# EasyEDA Pro project Summer Robot.eprj, schematic Motor Control Unit

## Sheets
1 Wrong Do Not Use!: Board Name: Motor Control Unit; Create Date: 2025-05-18; Page Name: P1; Project Name: Summer Robot; Schematic Name: Motor Control Unit; Update Date: 2025-12-27; Company: Ethan Reynolds; Drawn: 2025-05-17; Page Size: A4; Version: V1.0
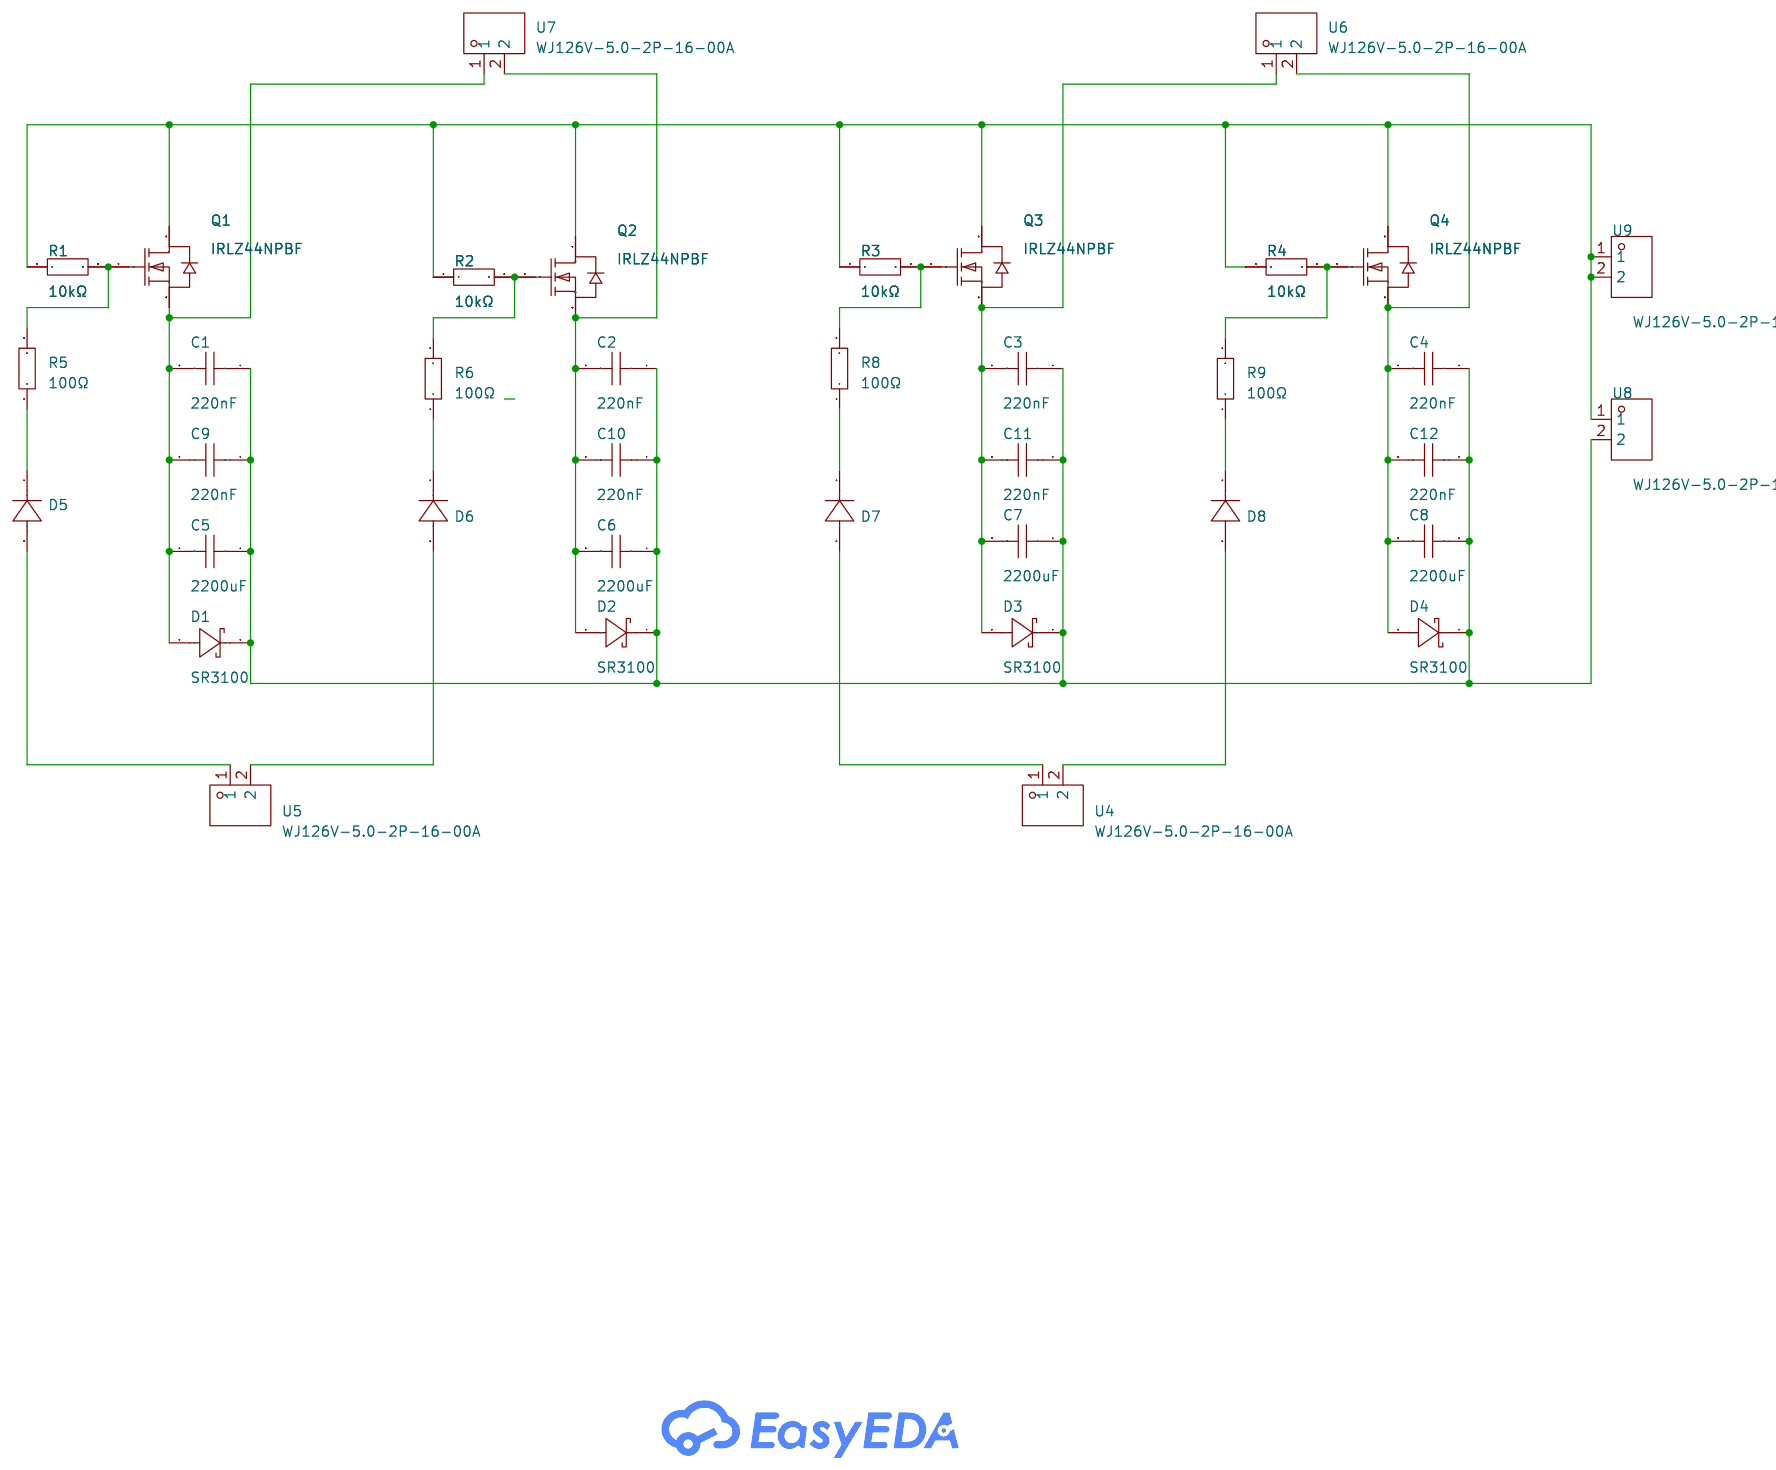
[diagram p0: Wrong Do Not Use!]
2 Revised: Create Date: 2026-01-07; Page Name: Revised; Update Date: 2026-01-06
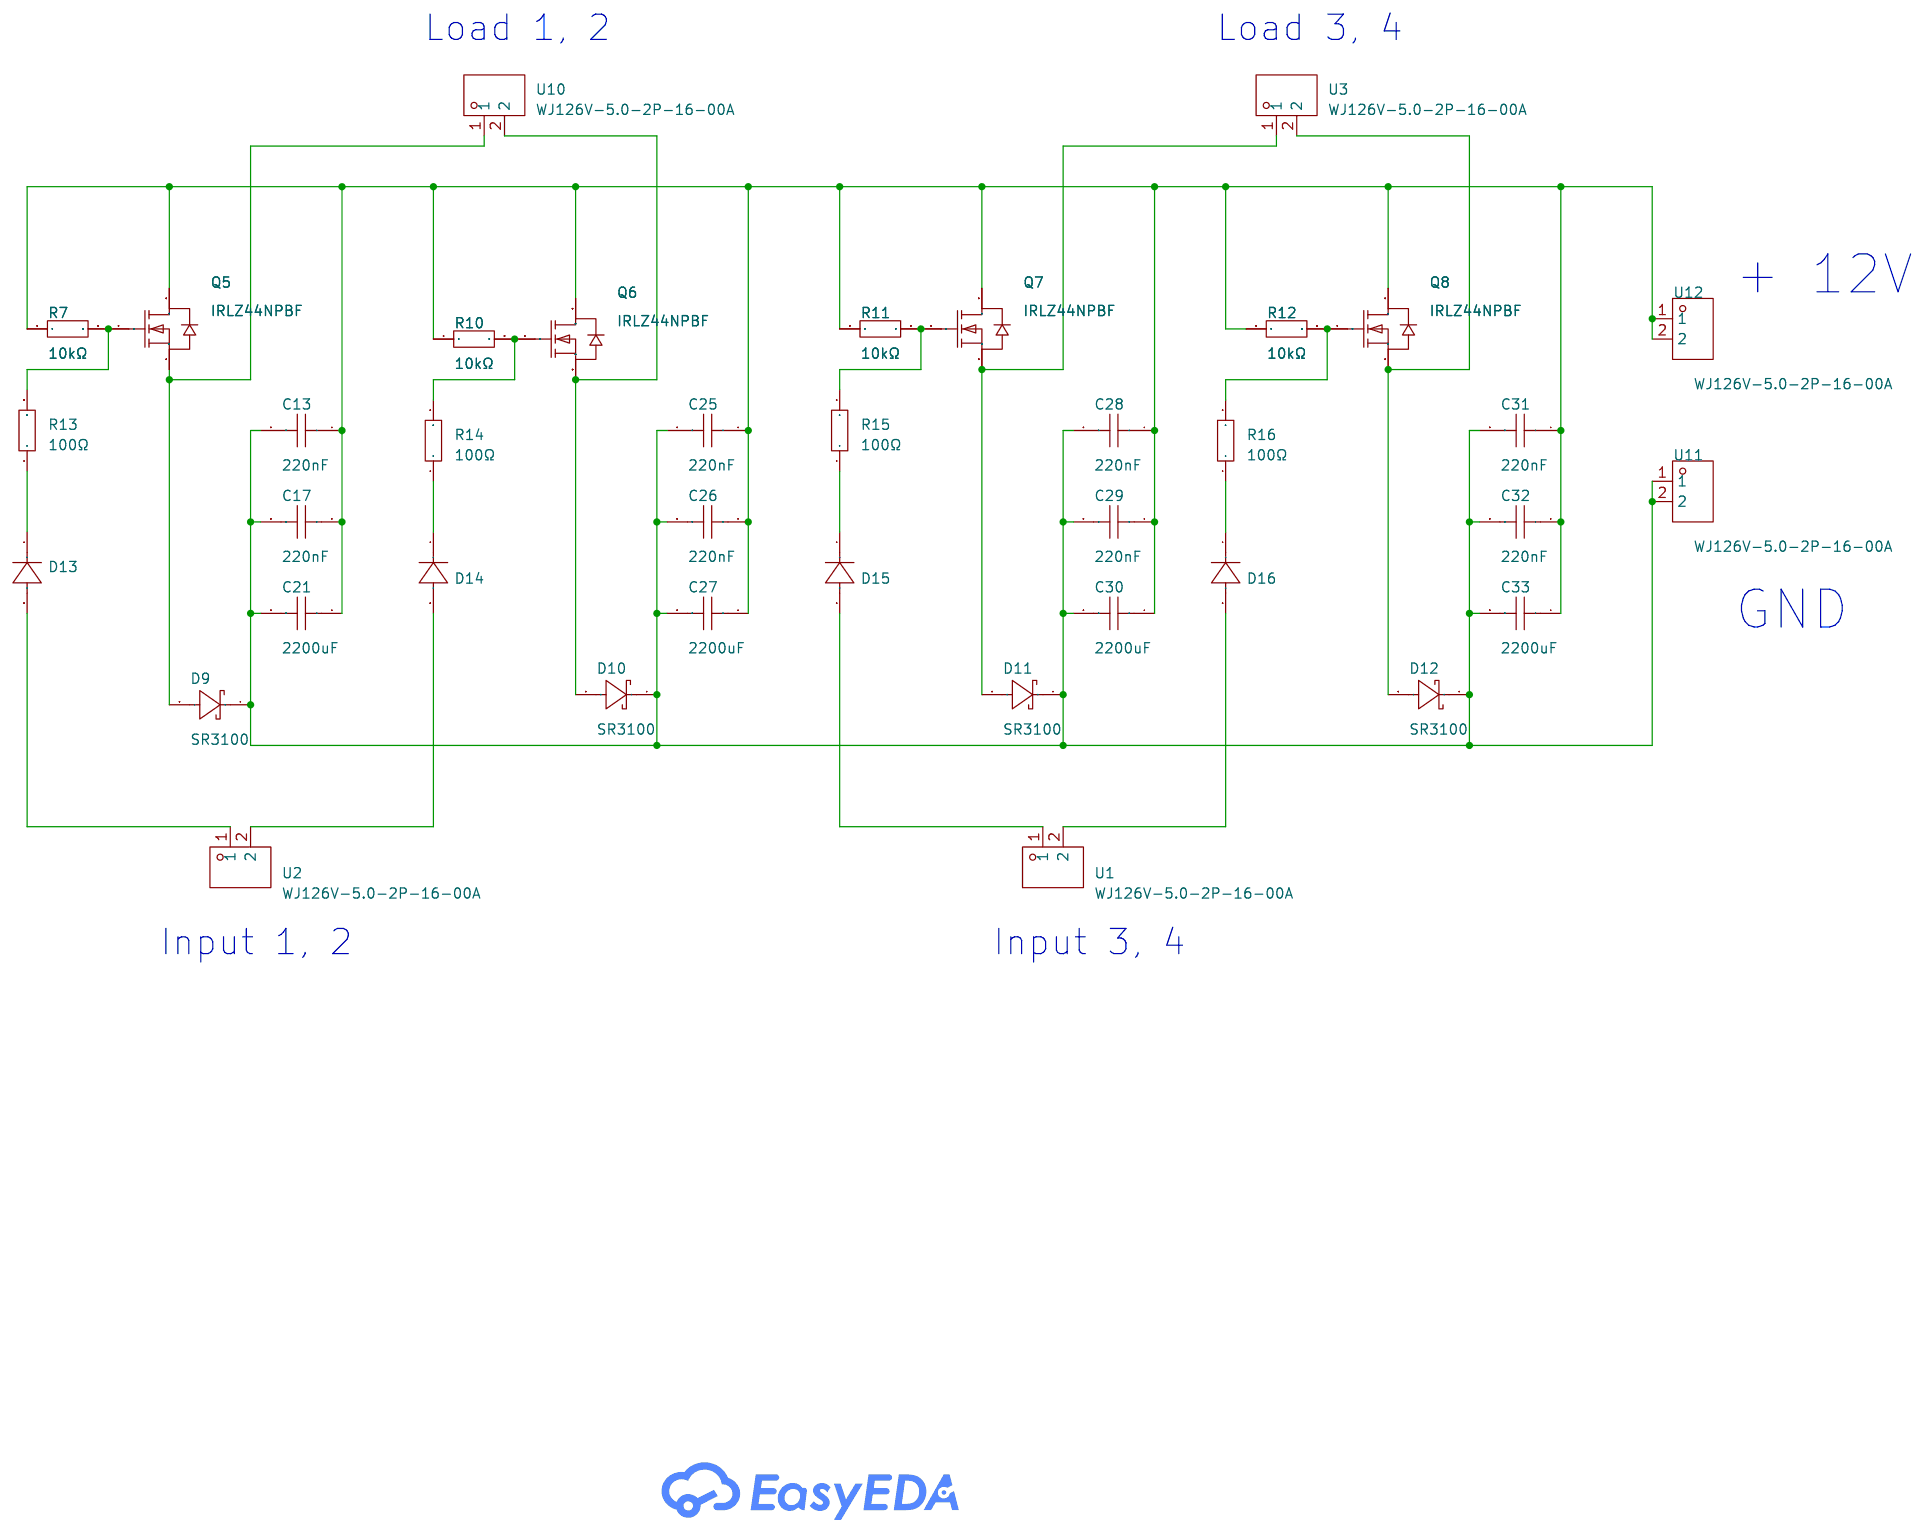
[diagram p1: Revised]
3 Final Version: Create Date: 2026-03-10; Page Name: Final Version; Update Date: 2026-03-09
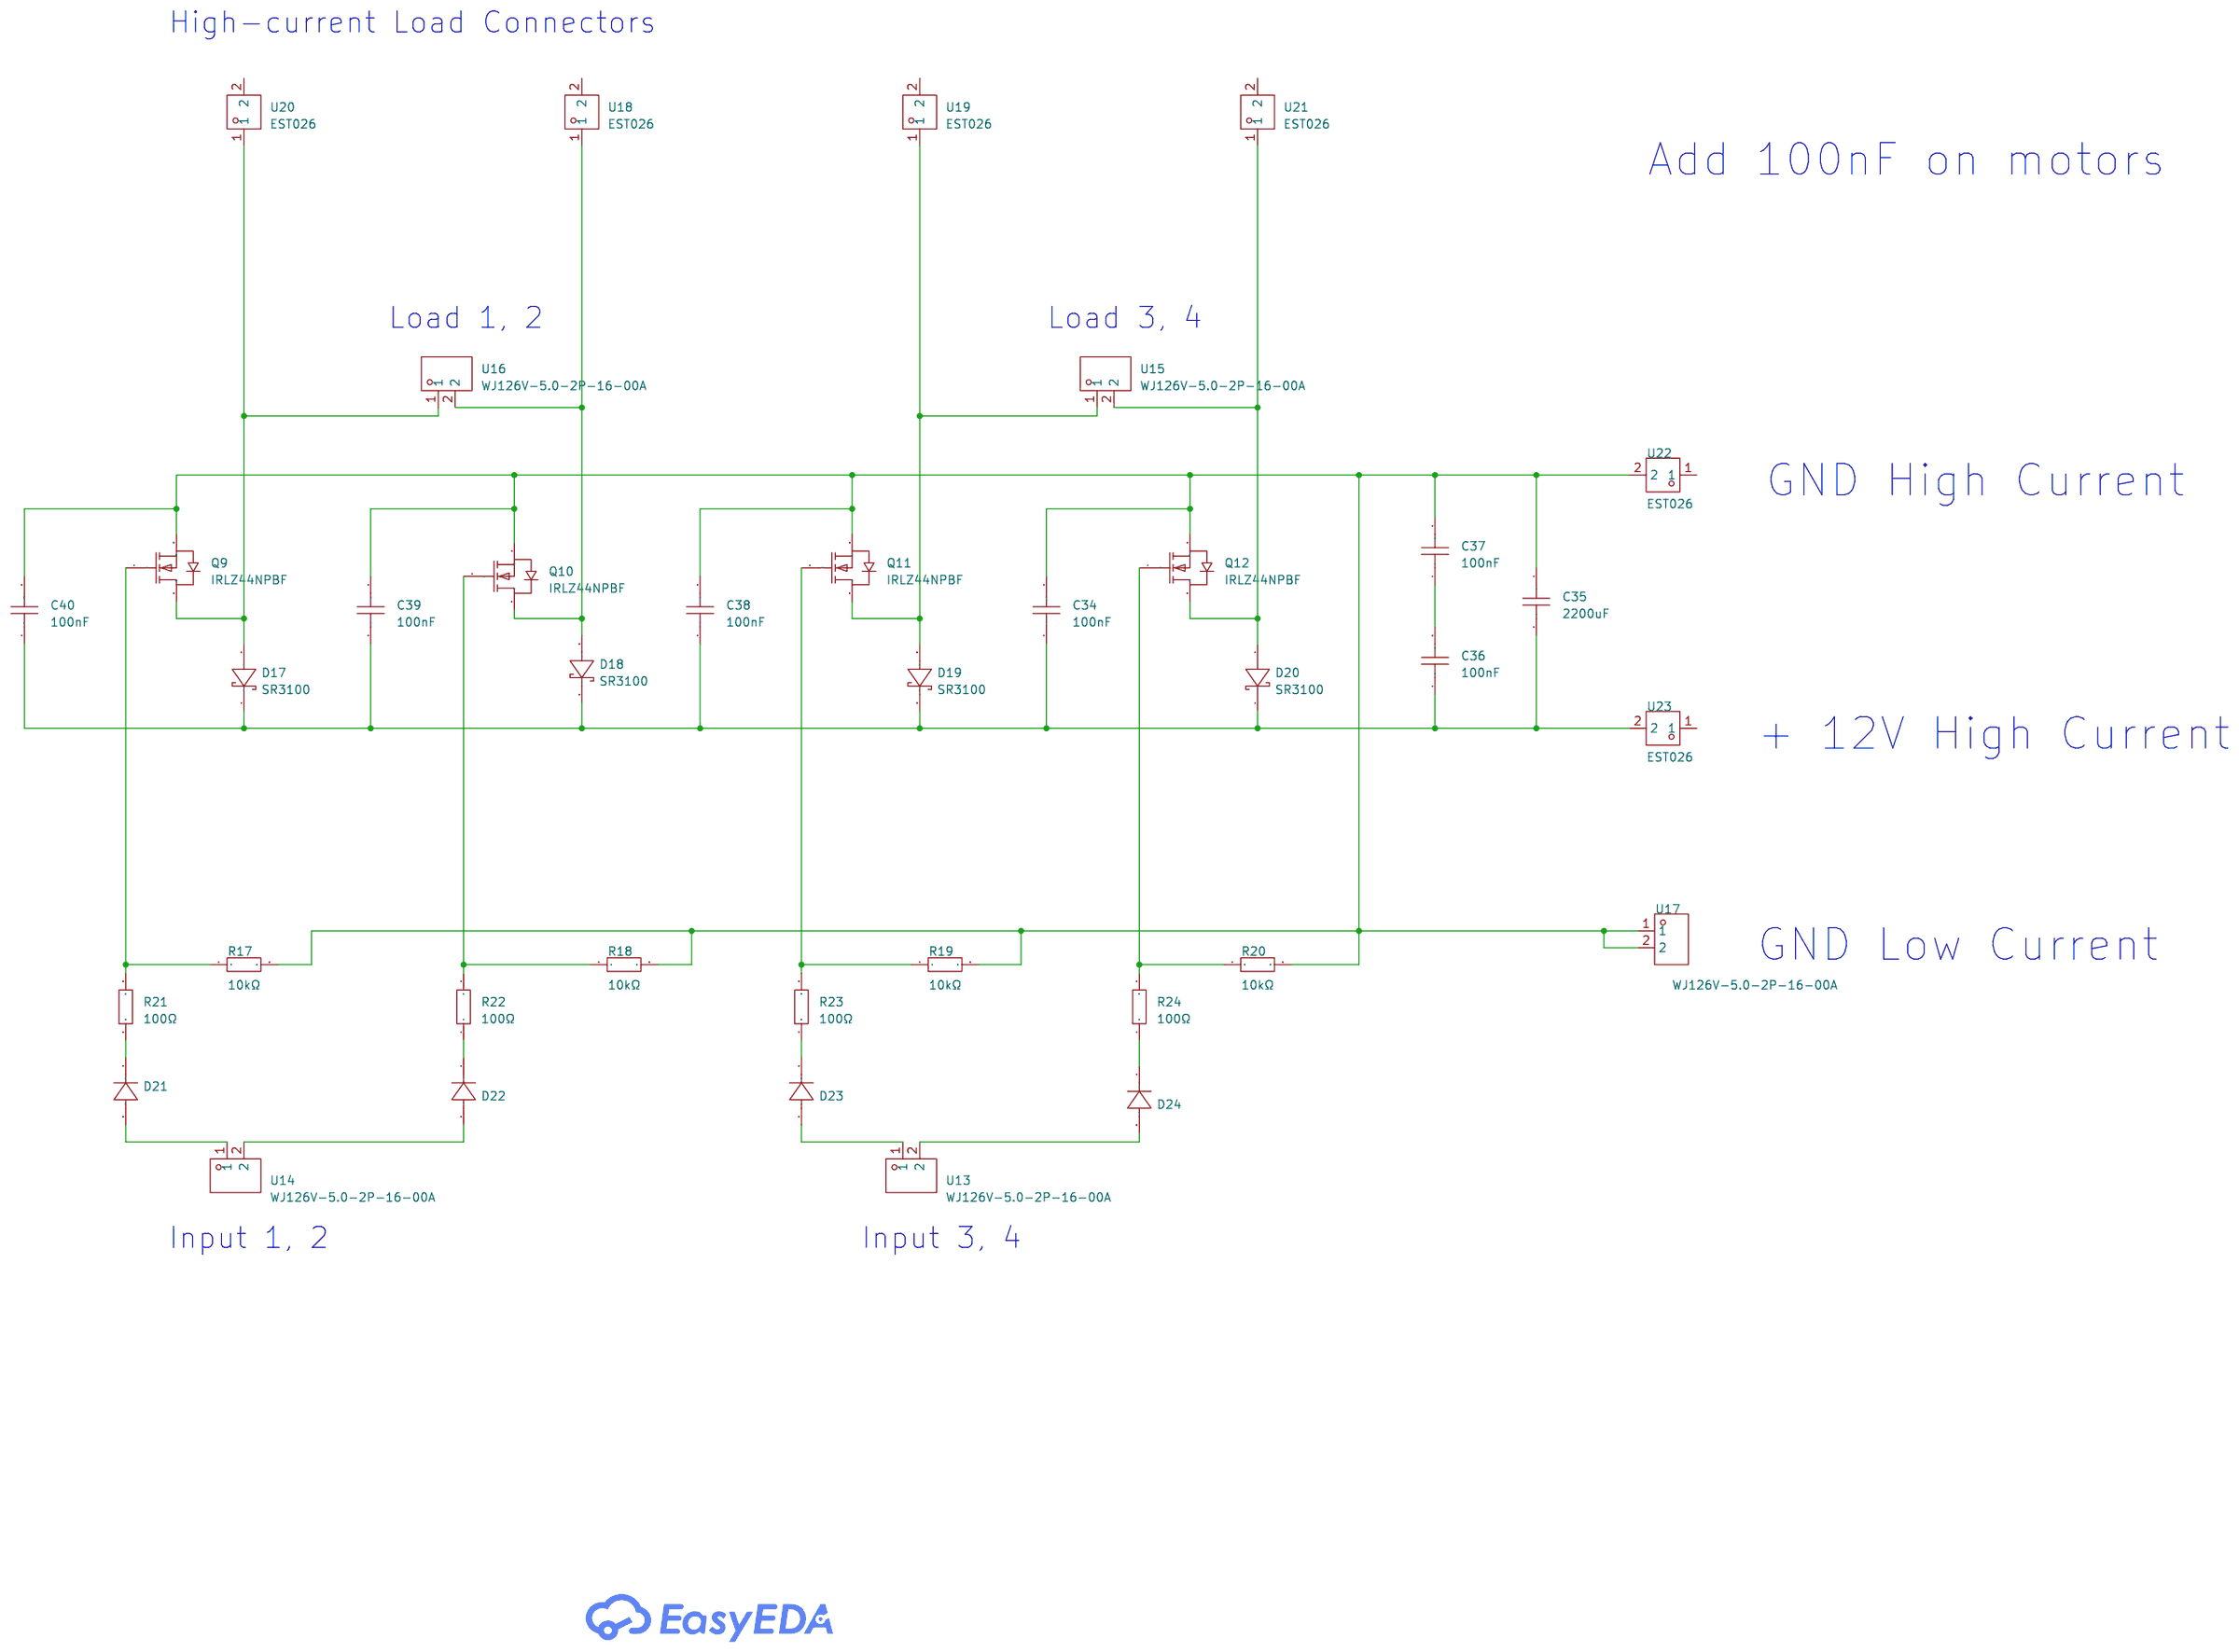
[diagram p2: Final Version]

## Parts
sheet Final Version
C34  100nF  [CAP-TH_L9.5-W4.5-P7.00-D0.5]
C35  2200uF  [CAP-TH_BD10.0-P5.00-D0.6-FD]
C36  100nF  [CAP-TH_L8.0-W4.5-P5.00-D0.5]
C37  100nF  [CAP-TH_L8.0-W4.5-P5.00-D0.5]
C38  100nF  [CAP-TH_L9.5-W4.5-P7.00-D0.5]
C39  100nF  [CAP-TH_L9.5-W4.5-P7.00-D0.5]
C40  100nF  [CAP-TH_L9.5-W4.5-P7.00-D0.5]
D17  SR3100  [DO-201AD_BD5.3-L8.4-P12.50-D1.4-RD]
D18  SR3100  [DO-201AD_BD5.3-L8.4-P12.50-D1.4-RD]
D19  SR3100  [DO-201AD_BD5.3-L8.4-P12.50-D1.4-RD]
D20  SR3100  [DO-201AD_BD5.3-L8.4-P12.50-D1.4-RD]
D21  -  [DO-41_BD2.4-L4.7-P8.70-D0.9-RD]
D22  -  [DO-41_BD2.4-L4.7-P8.70-D0.9-RD]
D23  -  [DO-41_BD2.4-L4.7-P8.70-D0.9-RD]
D24  -  [DO-41_BD2.4-L4.7-P8.70-D0.9-RD]
Q9  IRLZ44NPBF  [TO-220-3_L10.0-W4.5-P2.54-T]
Q10  IRLZ44NPBF  [TO-220-3_L10.0-W4.5-P2.54-T]
Q11  IRLZ44NPBF  [TO-220-3_L10.0-W4.5-P2.54-T]
Q12  IRLZ44NPBF  [TO-220-3_L10.0-W4.5-P2.54-T]
R17  10kΩ  [RES-TH_BD2.4-L6.3-P10.30-D0.6]
R18  10kΩ  [RES-TH_BD2.4-L6.3-P10.30-D0.6]
R19  10kΩ  [RES-TH_BD2.4-L6.3-P10.30-D0.6]
R20  10kΩ  [RES-TH_BD2.4-L6.3-P10.30-D0.6]
R21  100Ω  [RES-TH_BD4.0-L11.5-P15.50-D0.7]
R22  100Ω  [RES-TH_BD4.0-L11.5-P15.50-D0.7]
R23  100Ω  [RES-TH_BD4.0-L11.5-P15.50-D0.7]
R24  100Ω  [RES-TH_BD4.0-L11.5-P15.50-D0.7]
U13  WJ126V-5.0-2P-16-00A  [CONN-TH_WJ126V-5.0-2P]
U14  WJ126V-5.0-2P-16-00A  [CONN-TH_WJ126V-5.0-2P]
U15  WJ126V-5.0-2P-16-00A  [CONN-TH_WJ126V-5.0-2P]
U16  WJ126V-5.0-2P-16-00A  [CONN-TH_WJ126V-5.0-2P]
U17  WJ126V-5.0-2P-16-00A  [CONN-TH_WJ126V-5.0-2P]
U18  EST026  [CONN-TH_L6.3-W0.8-EST026]
U19  EST026  [CONN-TH_L6.3-W0.8-EST026]
U20  EST026  [CONN-TH_L6.3-W0.8-EST026]
U21  EST026  [CONN-TH_L6.3-W0.8-EST026]
U22  EST026  [CONN-TH_L6.3-W0.8-EST026]
U23  EST026  [CONN-TH_L6.3-W0.8-EST026]
sheet Revised
C13  220nF  [CAP-TH_L10.0-W2.7-P7.80-D0.4]
C17  220nF  [CAP-TH_L10.0-W2.7-P7.80-D0.4]
C21  2200uF  [CAP-TH_BD10.0-P5.00-D0.6-FD]
C25  220nF  [CAP-TH_L10.0-W2.7-P7.80-D0.4]
C26  220nF  [CAP-TH_L10.0-W2.7-P7.80-D0.4]
C27  2200uF  [CAP-TH_BD10.0-P5.00-D0.6-FD]
C28  220nF  [CAP-TH_L10.0-W2.7-P7.80-D0.4]
C29  220nF  [CAP-TH_L10.0-W2.7-P7.80-D0.4]
C30  2200uF  [CAP-TH_BD10.0-P5.00-D0.6-FD]
C31  220nF  [CAP-TH_L10.0-W2.7-P7.80-D0.4]
C32  220nF  [CAP-TH_L10.0-W2.7-P7.80-D0.4]
C33  2200uF  [CAP-TH_BD10.0-P5.00-D0.6-FD]
D9  SR3100  [DO-201AD_BD5.3-L8.4-P12.50-D1.4-RD]
D10  SR3100  [DO-201AD_BD5.3-L8.4-P12.50-D1.4-RD]
D11  SR3100  [DO-201AD_BD5.3-L8.4-P12.50-D1.4-RD]
D12  SR3100  [DO-201AD_BD5.3-L8.4-P12.50-D1.4-RD]
D13  -  [DO-41_BD2.4-L4.7-P8.70-D0.9-RD]
D14  -  [DO-41_BD2.4-L4.7-P8.70-D0.9-RD]
D15  -  [DO-41_BD2.4-L4.7-P8.70-D0.9-RD]
D16  -  [DO-41_BD2.4-L4.7-P8.70-D0.9-RD]
Q5  IRLZ44NPBF  [TO-220-3_L10.0-W4.5-P2.54-T]
Q6  IRLZ44NPBF  [TO-220-3_L10.0-W4.5-P2.54-T]
Q7  IRLZ44NPBF  [TO-220-3_L10.0-W4.5-P2.54-T]
Q8  IRLZ44NPBF  [TO-220-3_L10.0-W4.5-P2.54-T]
R7  10kΩ  [RES-TH_BD2.4-L6.3-P10.30-D0.6]
R10  10kΩ  [RES-TH_BD2.4-L6.3-P10.30-D0.6]
R11  10kΩ  [RES-TH_BD2.4-L6.3-P10.30-D0.6]
R12  10kΩ  [RES-TH_BD2.4-L6.3-P10.30-D0.6]
R13  100Ω  [RES-TH_BD4.0-L11.5-P15.50-D0.7]
R14  100Ω  [RES-TH_BD4.0-L11.5-P15.50-D0.7]
R15  100Ω  [RES-TH_BD4.0-L11.5-P15.50-D0.7]
R16  100Ω  [RES-TH_BD4.0-L11.5-P15.50-D0.7]
U1  WJ126V-5.0-2P-16-00A  [CONN-TH_WJ126V-5.0-2P]
U2  WJ126V-5.0-2P-16-00A  [CONN-TH_WJ126V-5.0-2P]
U3  WJ126V-5.0-2P-16-00A  [CONN-TH_WJ126V-5.0-2P]
U10  WJ126V-5.0-2P-16-00A  [CONN-TH_WJ126V-5.0-2P]
U11  WJ126V-5.0-2P-16-00A  [CONN-TH_WJ126V-5.0-2P]
U12  WJ126V-5.0-2P-16-00A  [CONN-TH_WJ126V-5.0-2P]
sheet Wrong Do Not Use!
C1  220nF  [CAP-TH_L10.0-W2.7-P7.80-D0.4]
C2  220nF  [CAP-TH_L10.0-W2.7-P7.80-D0.4]
C3  220nF  [CAP-TH_L10.0-W2.7-P7.80-D0.4]
C4  220nF  [CAP-TH_L10.0-W2.7-P7.80-D0.4]
C5  2200uF  [CAP-TH_BD10.0-P5.00-D0.6-FD]
C6  2200uF  [CAP-TH_BD10.0-P5.00-D0.6-FD]
C7  2200uF  [CAP-TH_BD10.0-P5.00-D0.6-FD]
C8  2200uF  [CAP-TH_BD10.0-P5.00-D0.6-FD]
C9  220nF  [CAP-TH_L10.0-W2.7-P7.80-D0.4]
C10  220nF  [CAP-TH_L10.0-W2.7-P7.80-D0.4]
C11  220nF  [CAP-TH_L10.0-W2.7-P7.80-D0.4]
C12  220nF  [CAP-TH_L10.0-W2.7-P7.80-D0.4]
D1  SR3100  [DO-201AD_BD5.3-L8.4-P12.50-D1.4-RD]
D2  SR3100  [DO-201AD_BD5.3-L8.4-P12.50-D1.4-RD]
D3  SR3100  [DO-201AD_BD5.3-L8.4-P12.50-D1.4-RD]
D4  SR3100  [DO-201AD_BD5.3-L8.4-P12.50-D1.4-RD]
D5  -  [DO-41_BD2.4-L4.7-P8.70-D0.9-RD]
D6  -  [DO-41_BD2.4-L4.7-P8.70-D0.9-RD]
D7  -  [DO-41_BD2.4-L4.7-P8.70-D0.9-RD]
D8  -  [DO-41_BD2.4-L4.7-P8.70-D0.9-RD]
Q1  IRLZ44NPBF  [TO-220-3_L10.0-W4.5-P2.54-T]
Q2  IRLZ44NPBF  [TO-220-3_L10.0-W4.5-P2.54-T]
Q3  IRLZ44NPBF  [TO-220-3_L10.0-W4.5-P2.54-T]
Q4  IRLZ44NPBF  [TO-220-3_L10.0-W4.5-P2.54-T]
R1  10kΩ  [RES-TH_BD2.4-L6.3-P10.30-D0.6]
R2  10kΩ  [RES-TH_BD2.4-L6.3-P10.30-D0.6]
R3  10kΩ  [RES-TH_BD2.4-L6.3-P10.30-D0.6]
R4  10kΩ  [RES-TH_BD2.4-L6.3-P10.30-D0.6]
R5  100Ω  [RES-TH_BD4.0-L11.5-P15.50-D0.7]
R6  100Ω  [RES-TH_BD4.0-L11.5-P15.50-D0.7]
R8  100Ω  [RES-TH_BD4.0-L11.5-P15.50-D0.7]
R9  100Ω  [RES-TH_BD4.0-L11.5-P15.50-D0.7]
U4  WJ126V-5.0-2P-16-00A  [CONN-TH_WJ126V-5.0-2P]
U5  WJ126V-5.0-2P-16-00A  [CONN-TH_WJ126V-5.0-2P]
U6  WJ126V-5.0-2P-16-00A  [CONN-TH_WJ126V-5.0-2P]
U7  WJ126V-5.0-2P-16-00A  [CONN-TH_WJ126V-5.0-2P]
U8  WJ126V-5.0-2P-16-00A  [CONN-TH_WJ126V-5.0-2P]
U9  WJ126V-5.0-2P-16-00A  [CONN-TH_WJ126V-5.0-2P]

## Library data of the parts
C34 C38-C40 = 2A104J114CL006: Capacitance:100nF Tolerance:±5% Tolerance:±5% Voltage Rating:100V Dielectric Material:Polyester Operating Temperature:-40℃~+85℃ Operating Temperature:-40℃~+85℃; LCSC Part Name: 100nF ±5% 100V; Supplier Part: C2764150; Manufacturer: KNSCHA(科尼盛); Supplier Footprint: 插件,P=7mm; JLCPCB Part Class: Extended Part; Datasheet: https://item.szlcsc.com/datasheet/2A104J114CL006/2895837.html; Supplier: LCSC; Tolerance: ±5%; Voltage Rating: 100V; Dielectric Material: Polyester; Operating Temperature: -40℃~+85℃
C5-C8 C21 C27 C30 C33 C35 = EKZE160ELL222MJ25S: Capacitance: Tolerance:±20% Tolerance:±20% Rated Voltage: Ripple Current:- Equivalent Series Resistance(ESR):- Lead Spacing: φD: L: Lifetime @ Temp:5000hrs@105℃; LCSC Part Name: 2200uF ±20% 16V; Supplier Part: C320010; Manufacturer: NCC(日本贵弥功); Supplier Footprint: 插件,D10xL25mm; JLCPCB Part Class: Extended Part; Datasheet: https://atta.szlcsc.com/upload/public/pdf/source/20190311/C320010_4ADC44D1D3213EF7D3C5B91987F675CC.pdf; Supplier: LCSC; Tolerance: ±20%; Lifetime @ Temp: 5000hrs@105℃
C36 C37 = CL11-2A104J-100V: Capacitance:100nF Tolerance:±5% Tolerance:±5% Voltage Rating:100V Dielectric Material:Polyester Operating Temperature:-40℃~+85℃ Operating Temperature:-40℃~+85℃; LCSC Part Name: 100nF ±5% 100V; Supplier Part: C914544; Manufacturer: NDF(达孚); Supplier Footprint: 插件,P=5mm; JLCPCB Part Class: Extended Part; Datasheet: https://item.szlcsc.com/datasheet/CL11-2A104J-100V/985442.html; Supplier: LCSC; Tolerance: ±5%; Voltage Rating: 100V; Dielectric Material: Polyester; Operating Temperature: -40℃~+85℃
D1-D4 D9-D12 D17-D20 = SR3100_C698900: LCSC Part Name: 电压:100V 电流:3A; Supplier Part: C698900; Manufacturer: YANGJIE(扬杰); Supplier Footprint: DO-27; JLCPCB Part Class: Extended Part; Datasheet: https://atta.szlcsc.com/upload/public/pdf/source/20200709/C698900_6D78AD0DF45561612416347AC03E8208.pdf; Supplier: LCSC; Diode Configuration: Independent Type; Voltage - Forward(Vf@If): 850mV@3A; Voltage - DC Reverse(Vr): 100V; Current - Rectified: 3A; Reverse Leakage Current (Ir): 100uA@100V
D5-D8 D13-D16 D21-D24 = 1N4007: Supplier Footprint: DO-41
Q1-Q12 = IRLZ44NPBF: LCSC Part Name: 1个N沟道 耐压:55V 电流:47A; Supplier Part: C38774; Manufacturer: Infineon(英飞凌); Supplier Footprint: TO-220AB; JLCPCB Part Class: Extended Part; Datasheet: https://atta.szlcsc.com/upload/public/pdf/source/20141125/1457707250505.pdf; Supplier: LCSC; Type: 1 N-Channel; Drain Source On Resistance (RDS(on)@Vgs,Id): 0.025Ω@5.0V,25A; Gate Threshold Voltage (Vgs(th)@Id): 1V@250uA; Total Gate Charge (Qg@Vgs): 48nC; Input Capacitance (Ciss@Vds): 1.7nF; Reverse Transfer Capacitance (Crss@Vds): 150pF; Operating Temperature: -55℃~+175℃
R1-R4 R7 R10-R12 R17-R20 = RN1/4W10KFT/BA1: Type:Metal Film Resistors Resistance:10kΩ Tolerance:±1% Tolerance:±1% Voltage-Supply(Max):250V Power(Watts):1/4W Temperature Coefficient:±50ppm/℃ Temperature Coefficient:±50ppm/℃ Operating Temperature:-55℃~+125℃ Operating Temperature:-55℃~+125℃; LCSC Part Name: 10kΩ ±1% 250mW 金属膜电阻; Supplier Part: C410695; Manufacturer: Tyohm(幸亚电阻); Supplier Footprint: 插件,D2.4xL6.5mm; JLCPCB Part Class: Extended Part; Datasheet: https://atta.szlcsc.com/upload/public/pdf/source/20250211/2C0505E212032D72CE625B2E6B5197BA.pdf; Supplier: LCSC; Type: Metal Film Resistors; Tolerance: ±1%; Voltage-Supply(Max): 250V; Power(Watts): 1/4W; Temperature Coefficient: ±50ppm/℃; Operating Temperature: -55℃~+125℃
R5 R6 R8 R9 R13-R16 R21-R24 = MF1W-100Ω±1% T: Type:Metal Film Resistors Resistance: Tolerance:±1% Tolerance:±1% Voltage-Supply(Max):350V Power(Watts):1W Temperature Coefficient:±100ppm/℃ Temperature Coefficient:±100ppm/℃ Operating Temperature:-55℃~+155℃ Operating Temperature:-55℃~+155℃; LCSC Part Name: 100Ω ±1% 1W 金属膜电阻; Supplier Part: C119469; Manufacturer: CCO(千志电子); Supplier Footprint: 插件,D4.5xL11.5mm; JLCPCB Part Class: Extended Part; Datasheet: https://atta.szlcsc.com/upload/public/pdf/source/20190910/C427326_62A6D058BC0FF74963A2F22379CA06CE.pdf; Supplier: LCSC; Type: Metal Film Resistors; Tolerance: ±1%; Voltage-Supply(Max): 350V; Power(Watts): 1W; Temperature Coefficient: ±100ppm/℃; Operating Temperature: -55℃~+155℃
U1-U17 = WJ126V-5.0-2P-16-00A: LCSC Part Name: 直插式/5.0mm 2P 红色; Supplier Part: C3031437; Manufacturer: KANGNEX(康奈克斯电气); Supplier Footprint: P=5mm; JLCPCB Part Class: Extended Part; Datasheet: https://atta.szlcsc.com/upload/public/pdf/source/20191225/C8379_3D37D98EF6F0ECCD8D2EB72C93E46299.pdf; Supplier: LCSC
U18-U23 = EST026: LCSC Part Name: 插片端子-6.3mm; Supplier Part: C52878; Manufacturer: xcfuse(旭程); Supplier Footprint: 插件; JLCPCB Part Class: Extended Part; Datasheet: https://item.szlcsc.com/datasheet/EST026/53893.html; Supplier: LCSC
C1-C4 C9-C13 C17 C25 C26 C28 C29 C31 C32 = MPE224J100V82CL0045: Capacitance:220nF Tolerance:±5% Tolerance:±5% Voltage Rated: Dielectric Material:Metallized Polyester Operating Temperature:-55℃~+85℃ Operating Temperature:-55℃~+85℃; LCSC Part Name: 220nF ±5% 100V; Supplier Part: C2803185; Manufacturer: KNSCHA(科尼盛); Supplier Footprint: 插件,P=5mm; JLCPCB Part Class: Extended Part; Datasheet: https://atta.szlcsc.com/upload/public/pdf/source/20210420/C2803185_E3321C8762E86646BB5DB6CDE5AB9948.pdf; Supplier: LCSC; Tolerance: ±5%; Dielectric Material: Metallized Polyester; Operating Temperature: -55℃~+85℃

## Nets
$5N1382: Q11.1(G) R19.1 R23.2
$5N1386: Q9.1(G) R17.1 R21.2
$5N1571: D22.1(K) R22.1
$5N1611: D21.1(K) R21.1
$5N2155: D21.2(A) U14.1
$5N2160: D22.2(A) U14.2
$5N19714: Q12.1(G) R20.1 R24.2
$5N20412: Q10.1(G) R18.1 R22.2
$5N20429: D23.2(A) U13.1
$5N20459: D23.1(K) R23.1
$5N20478: D24.2(A) U13.2
$5N20531: D24.1(K) R24.1
$5N21225: D20.2(A) Q12.2(D) U15.2 U21.1
$5N21289: D17.2(A) Q9.2(D) U16.1 U20.1
$5N21351: D18.2(A) Q10.2(D) U16.2 U18.1
$5N21413: D19.2(A) Q11.2(D) U15.1 U19.1
$5N21508: C36.2 C37.1
Net-(C1-1): C1.1 C2.1 C3.1 C4.1 C5.1 C6.1 C7.1 C8.1 C9.1 C10.1 C11.1 C12.1 D1.1(K) D2.1(K) D3.1(K) D4.1(K) U8.2
Net-(C1-2): C1.2 C5.2 C9.2 D1.2(A) Q1.3(S) U7.1
Net-(C2-2): C2.2 C6.2 C10.2 D2.2(A) Q2.3(S) U7.2
Net-(C3-2): C3.2 C7.2 C11.2 D3.2(A) Q3.3(S) U6.1
Net-(C4-2): C4.2 C8.2 C12.2 D4.2(A) Q4.3(S) U6.2
Net-(C13-1): C13.1 C17.1 C21.1 C25.1 C26.1 C27.1 C28.1 C29.1 C30.1 C31.1 C32.1 C33.1 Q5.2(D) Q6.2(D) Q7.2(D) Q8.2(D) R7.1 R10.1 R11.1 R12.1 U12.1 U12.2
Net-(C13-2): C13.2 C17.2 C21.2 C25.2 C26.2 C27.2 C28.2 C29.2 C30.2 C31.2 C32.2 C33.2 D9.1(K) D10.1(K) D11.1(K) D12.1(K) U11.1 U11.2
Net-(C34-1): C34.1 C35.2 C36.1 C38.1 C39.1 C40.1 D17.1(K) D18.1(K) D19.1(K) D20.1(K) U23.2
Net-(C34-2): C34.2 C35.1 C37.2 C38.2 C39.2 C40.2 Q9.3(S) Q10.3(S) Q11.3(S) Q12.3(S) R17.2 R18.2 R19.2 R20.2 U17.1 U17.2 U22.2
Net-(D5-1): D5.1(K) R5.1
Net-(D5-2): D5.2(A) U5.1
Net-(D6-1): D6.1(K) R6.1
Net-(D6-2): D6.2(A) U5.2
Net-(D7-1): D7.1(K) R8.1
Net-(D7-2): D7.2(A) U4.1
Net-(D8-1): D8.1(K) R9.1
Net-(D8-2): D8.2(A) U4.2
Net-(D9-2): D9.2(A) Q5.3(S) U10.1
Net-(D10-2): D10.2(A) Q6.3(S) U10.2
Net-(D11-2): D11.2(A) Q7.3(S) U3.1
Net-(D12-2): D12.2(A) Q8.3(S) U3.2
Net-(D13-1): D13.1(K) R13.1
Net-(D13-2): D13.2(A) U2.1
Net-(D14-1): D14.1(K) R14.1
Net-(D14-2): D14.2(A) U2.2
Net-(D15-1): D15.1(K) R15.1
Net-(D15-2): D15.2(A) U1.1
Net-(D16-1): D16.1(K) R16.1
Net-(D16-2): D16.2(A) U1.2
Net-(Q1-1): Q1.1(G) R1.2 R5.2
Net-(Q1-2): Q1.2(D) Q2.2(D) Q3.2(D) Q4.2(D) R1.1 R2.1 R3.1 R4.1 U8.1 U9.1 U9.2
Net-(Q2-1): Q2.1(G) R2.2 R6.2
Net-(Q3-1): Q3.1(G) R3.2 R8.2
Net-(Q4-1): Q4.1(G) R4.2 R9.2
Net-(Q5-1): Q5.1(G) R7.2 R13.2
Net-(Q6-1): Q6.1(G) R10.2 R14.2
Net-(Q7-1): Q7.1(G) R11.2 R15.2
Net-(Q8-1): Q8.1(G) R12.2 R16.2

Not connected (* = marked no-connect by the designer): U18 2; U19 2; U20 2; U21 2; U22 1; U23 1

## Notes on the sheets
sheet 2
- Load 1, 2
- Load 3, 4
- + 12V
- GND
- Input 1, 2
- Input 3, 4
sheet 3
- High-current Load Connectors
- Add 100nF on motors
- Load 1, 2
- Load 3, 4
- GND High Current
- + 12V High Current
- GND Low Current
- Input 1, 2
- Input 3, 4
